# Altium schematic sheet motor driver 1.SchDoc
size A4; SheetNumber: 5; SheetTotal: 9
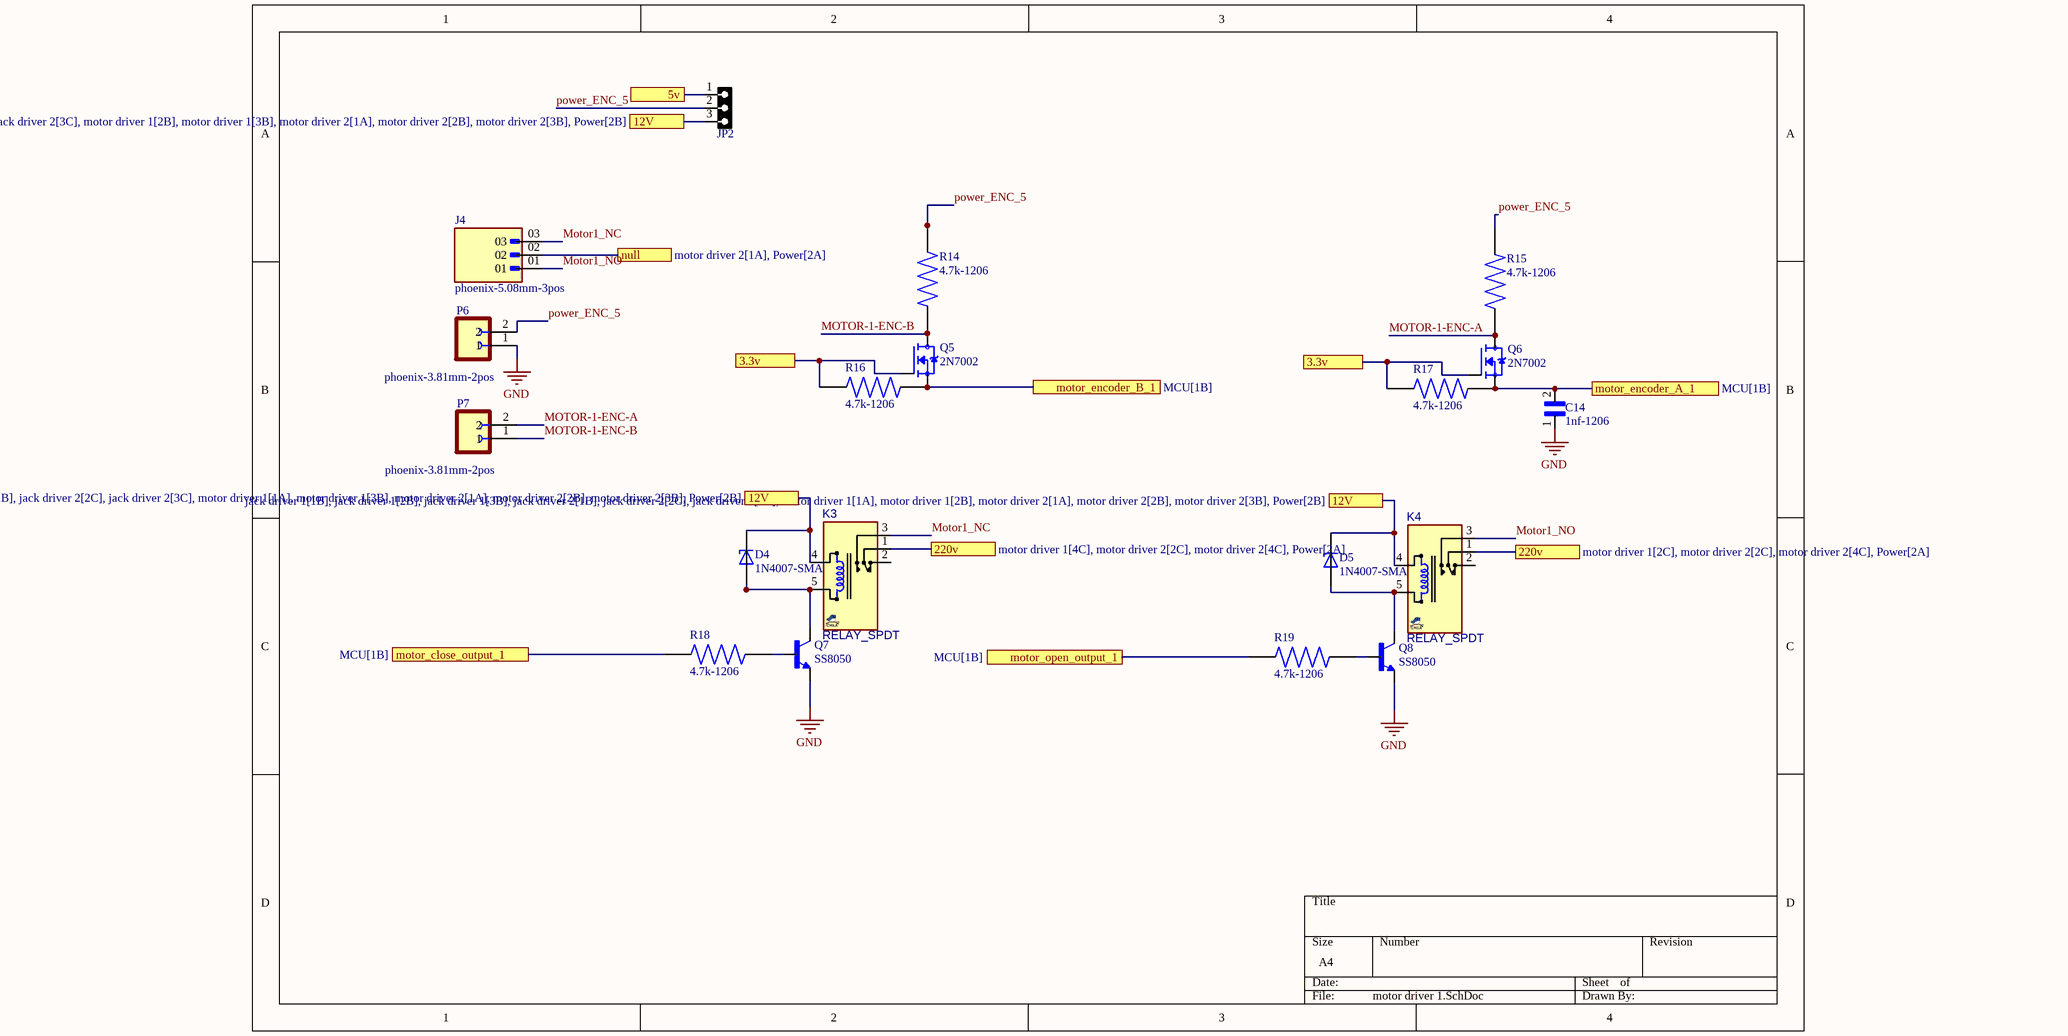
[diagram p0: motor driver 1.SchDoc]

## Parts
C14  1nf-1206  [CAPC3216X180N]
D4  1N4007-SMA  [DIOM4325X250N]
D5  1N4007-SMA  [DIOM4325X250N]
J4  phoenix-5.08mm-3pos  [PHOENIX_1759020]
JP2  HDRF3  [HDRLP_F_1X3]  (value not drawn)
K3  RELAY_SPDT  [REL_SPDT_5_1512]
K4  RELAY_SPDT  [REL_SPDT_5_1512]
P6  phoenix-3.81mm-2pos  [PHOENIX_1803578]
P7  phoenix-3.81mm-2pos  [PHOENIX_1803578]
Q5  2N7002  [SOT95P240X111-3N]
Q6  2N7002  [SOT95P240X111-3N]
Q7  SS8050  [TRANS_SS8050-G]
Q8  SS8050  [TRANS_SS8050-G]
R14  4.7k-1206  [RESC3015X65N]
R15  4.7k-1206  [RESC3015X65N]
R16  4.7k-1206  [RESC3015X65N]
R17  4.7k-1206  [RESC3015X65N]
R18  4.7k-1206  [RESC3015X65N]
R19  4.7k-1206  [RESC3015X65N]

## Ports
3.3v (see interface[0D], interface[1D], interface[3C], jack driver 1[2A], jack driver 1[3B], jack driver 2[2A], jack driver 2[3B], motor driver 1[2B], motor driver 2[2B], motor driver 2[3B], Power[2D], receiver 1[2A], receiver 1[2C], receiver 1[4A], receiver 1[4C], receiver 2[2A], receiver 2[2C], receiver 2[4A], receiver 2[4C]), 3.3v (see interface[0D], interface[1D], interface[3C], jack driver 1[2A], jack driver 1[3B], jack driver 2[2A], jack driver 2[3B], motor driver 1[3B], motor driver 2[2B], motor driver 2[3B], Power[2D], receiver 1[2A], receiver 1[2C], receiver 1[4A], receiver 1[4C], receiver 2[2A], receiver 2[2C], receiver 2[4A], receiver 2[4C]), 5v (see interface[1A], interface[1B], interface[1C], interface[2A], interface[2B], interface[2C], interface[3A], interface[3B], interface[4A], interface[4B], jack driver 1[1B], jack driver 2[1B], MCU[1A], motor driver 2[1A], Power[2C]), 12V (see jack driver 1[1B], jack driver 1[2B], jack driver 1[3B], jack driver 2[1B], jack driver 2[2C], jack driver 2[3C], motor driver 1[1A], motor driver 1[2B], motor driver 2[1A], motor driver 2[2B], motor driver 2[3B], Power[2B]), 12V (see jack driver 1[1B], jack driver 1[2B], jack driver 1[3B], jack driver 2[1B], jack driver 2[2C], jack driver 2[3C], motor driver 1[1A], motor driver 1[3B], motor driver 2[1A], motor driver 2[2B], motor driver 2[3B], Power[2B]), 12V (see jack driver 1[1B], jack driver 1[2B], jack driver 1[3B], jack driver 2[1B], jack driver 2[2C], jack driver 2[3C], motor driver 1[2B], motor driver 1[3B], motor driver 2[1A], motor driver 2[2B], motor driver 2[3B], Power[2B]), 220v (see motor driver 1[2C], motor driver 2[2C], motor driver 2[4C], Power[2A]), 220v (see motor driver 1[4C], motor driver 2[2C], motor driver 2[4C], Power[2A]), motor_close_output_1 (see MCU[1B]), motor_encoder_A_1 (see MCU[1B]), motor_encoder_B_1 (see MCU[1B]), motor_open_output_1 (see MCU[1B]), null (see motor driver 2[1A], Power[2A])

## Nets
GND: C14.1 P6.1 Q7.2(E) Q8.2(E)
3.3v: Q5.1(G) Q6.1(G) R16.2 R17.2 ; port 3.3v
5v: JP2.1 ; port 5v
12V: D4.C D5.C JP2.3 K3.4(T1) K4.4(T1) ; port 12V
220v: K3.1(COM) K4.1(COM) ; port 220v
Motor1_NC: J4.03 K3.3(NO)
Motor1_NO: J4.01 K4.3(NO)
MOTOR-1-ENC-A: P7.2 Q6.3(D) R15.1
MOTOR-1-ENC-B: P7.1 Q5.3(D) R14.1
motor_close_output_1: R18.2 ; port motor_close_output_1
motor_encoder_A_1: C14.2 Q6.2(S) R17.1 ; port motor_encoder_A_1
motor_encoder_B_1: Q5.2(S) R16.1 ; port motor_encoder_B_1
motor_open_output_1: R19.2 ; port motor_open_output_1
null: J4.02 ; port null
power_ENC_5: JP2.2 P6.2 R14.2 R15.2
NetD4_A: D4.A K3.5(T2) Q7.3(C)
NetD5_A: D5.A K4.5(T2) Q8.3(C)
NetQ7_1: Q7.1(B) R18.1
NetQ8_1: Q8.1(B) R19.1

Not connected (* = marked no-connect by the designer): K3 2(NC); K4 2(NC)

## Library data of the parts
C14 = CGA5L3X8R1H105M160AB: 1ÂµF Â±20% 50V Ceramic Capacitor X8R 1206 (3216 Metric); MF: TDK; Value: *; Purchase-URL: https://pricing.snapeda.com/search/part/CGA5L3X8R1H105M160AB/?ref=eda; Package: 3216 TDK; Availability: In Stock; SnapEDA_Link: https://www.snapeda.com/parts/CGA5L3X8R1H105M160AB/TDK/view-part/?ref=snap; MP: CGA5L3X8R1H105M160AB; Check_prices: https://www.snapeda.com/parts/CGA5L3X8R1H105M160AB/TDK/view-part/?ref=eda; Price: None
D4 D5 = SMAJ26A: 400W, 30.4V, 5%, Unidirectional, TVS; MF: Taiwan Semiconductor; SnapEDA_Link: https://www.snapeda.com/parts/SMAJ26A/taiwan/view-part/?ref=snap; Package: SMA-2 Taiwan Semiconductor; Value: *; MP: SMAJ26A; Check_prices: https://www.snapeda.com/parts/SMAJ26A/taiwan/view-part/?ref=eda
J4 = 1759020: Pluggable Header 5.08mm 12AWG 320V 12A 3 Position COMBICON MSTB Series | Phoenix Contact 1759020; SnapEDA_Link: https://www.snapeda.com/parts/1759020/Phoenix+Contact/view-part/?ref=snap; Package: None; Value: *; MF: Phoenix Contact; MP: 1759020; Check_prices: https://www.snapeda.com/parts/1759020/Phoenix+Contact/view-part/?ref=eda
JP2 = HDRLP_F_1X3: CONN, HEADER, Male, pitch: 2.54mm, 3POS; VALUE: HDRF3
K3 K4 = RELAY_SPDT_5_1512_G8QN: Relay, SPDT, 5P, 15.4X12.1mm, 16V/30A; MANF: OMRON; MANF_P#: G8QN-1C4 DC12; PARAM2: 16VDC, 30A; PARAM: 12V, 50mA; PRICE: PRICE; Value: RELAY_SPDT
P6 P7 = 1803578: 2 Position Terminal Block Plug, Female Sockets 0.150 (3.81mm) 180Â° Free Hanging (In-Line); MF: Phoenix Contact; Price: None; Purchase-URL: https://pricing.snapeda.com/search/part/1803578/?ref=eda; Availability: Good; SnapEDA_Link: https://www.snapeda.com/parts/1803578/Phoenix%20Contact/view-part/46882/?ref=snap; MP: 1803578; Value: *; Check_prices: https://www.snapeda.com/parts/1803578/Phoenix%20Contact/view-part/46882/?ref=eda; Package: Custom Package Phoenix Contact
Q5 Q6 = 2N7002: N-Channel 60V 280mA (Ta) 350mW (Ta) Surface Mount SOT-23-3 (TO-236); MF: {'manufacturer': u'onsemi'}; Package: None; Price: None; Value: *; MP: 2N7002; Availability: Unavailable
Q7 Q8 = SS8050-G: Bipolar (BJT) Transistor NPN 25 V 1.5 A 100MHz 300 mW Surface Mount SOT-23-3; MP: SS8050G; MF: Comchip; Digi-Key_Part_Number: 641-1790-2-ND; Check_prices: https://www.snapeda.com/parts/SS8050G/Comchip/view-part/?ref=eda; Package: None; SnapEDA_Link: https://www.snapeda.com/parts/SS8050G/Comchip/view-part/?ref=snap; Value: *
R14-R19 = CPF1206B10KE1: Res Thin Film 1206 10K Ohm 0.1% 1/8W Â±25ppm/Â°C Molded SMD SMD Paper T/R; Power_Rating: .125 W; MF: TE Connectivity; Voltage_Rating: 150 V; Tolerance: .1%; SnapEDA_Link: https://www.snapeda.com/parts/CPF1206B10KE1/TE+Connectivity/view-part/?ref=snap; Package: 1206; Resistance: 10K; Value: *; MP: CPF1206B10KE1; EU_RoHS_Compliance: Compliant; Check_prices: https://www.snapeda.com/parts/CPF1206B10KE1/TE+Connectivity/view-part/?ref=eda